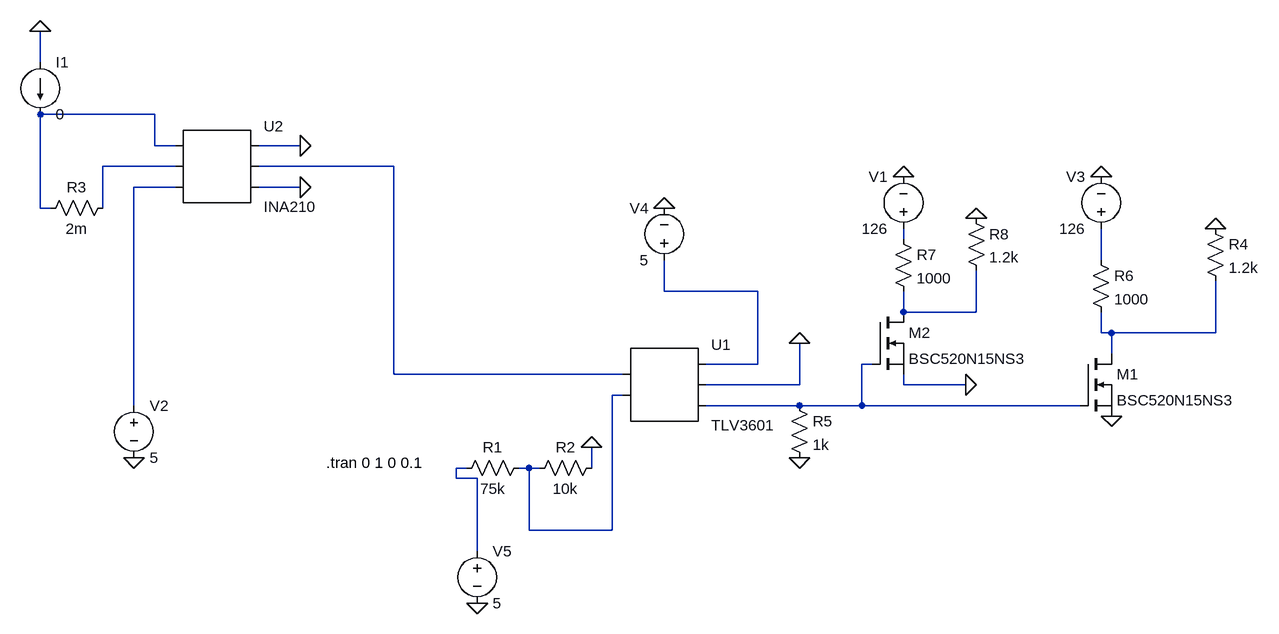
[diagram p0: schematic Discharge Circuit.asc]
Discharge Circuit.asc, the LTspice schematic file:
Version 4
SHEET 1 1844 680
WIRE -1040 -368 -1040 -416
WIRE -864 -288 -1040 -288
WIRE -864 -240 -864 -288
WIRE -832 -240 -864 -240
WIRE -640 -240 -704 -240
WIRE -832 -208 -944 -208
WIRE -496 -208 -704 -208
WIRE -832 -176 -896 -176
WIRE -640 -176 -704 -176
WIRE -1040 -144 -1040 -288
WIRE -1024 -144 -1040 -144
WIRE -944 -144 -944 -208
WIRE 288 -96 288 -112
WIRE 592 -64 592 -112
WIRE -80 -16 -80 -64
WIRE 64 -16 -80 -16
WIRE 288 16 288 -16
WIRE 400 16 400 -48
WIRE 400 16 288 16
WIRE 592 48 592 16
WIRE 608 48 592 48
WIRE 768 48 768 -32
WIRE 768 48 608 48
WIRE 608 80 608 48
WIRE 64 96 64 -16
WIRE 64 96 -16 96
WIRE 240 96 224 96
WIRE -496 112 -496 -208
WIRE -144 112 -496 112
WIRE 128 128 128 64
WIRE 128 128 -16 128
WIRE 288 128 288 112
WIRE 384 128 288 128
WIRE -144 144 -160 144
WIRE -896 160 -896 -176
WIRE 128 160 -16 160
WIRE 224 160 224 96
WIRE 224 160 128 160
WIRE 560 160 224 160
WIRE -384 256 -400 256
WIRE -288 256 -304 256
WIRE -272 256 -288 256
WIRE -192 256 -192 224
WIRE -400 272 -400 256
WIRE -368 272 -400 272
WIRE -288 352 -288 256
WIRE -160 352 -160 144
WIRE -160 352 -288 352
WIRE -368 384 -368 272
FLAG -192 224 0
FLAG -80 -144 0
FLAG -368 464 0
FLAG 128 64 0
FLAG -896 240 0
FLAG -640 -240 0
FLAG -640 -176 0
FLAG -1040 -416 0
FLAG 592 -192 0
FLAG 768 -112 0
FLAG 608 176 0
FLAG 128 240 0
FLAG 384 128 0
FLAG 400 -128 0
FLAG 288 -192 0
SYMBOL voltage -896 144 R0
WINDOW 123 0 0 Left 0
WINDOW 39 0 0 Left 0
SYMATTR InstName V2
SYMATTR Value 5
SYMBOL res -288 240 R90
WINDOW 0 0 56 VBottom 2
WINDOW 3 32 56 VTop 2
SYMATTR InstName R1
SYMATTR Value 75k
SYMBOL res -176 240 R90
WINDOW 0 0 56 VBottom 2
WINDOW 3 32 56 VTop 2
SYMATTR InstName R2
SYMATTR Value 10k
SYMBOL voltage -80 -48 R180
WINDOW 0 24 96 Left 2
WINDOW 3 24 16 Left 2
WINDOW 123 0 0 Left 0
WINDOW 39 0 0 Left 0
SYMATTR InstName V4
SYMATTR Value 5
SYMBOL voltage -368 368 R0
WINDOW 123 0 0 Left 0
WINDOW 39 0 0 Left 0
SYMATTR InstName V5
SYMATTR Value 5
SYMBOL AutoGenerated\\TLV3601 -80 128 R0
SYMATTR InstName U1
SYMBOL AutoGenerated\\INA210 -768 -208 R0
SYMATTR InstName U2
SYMBOL res -928 -160 R90
WINDOW 0 0 56 VBottom 2
WINDOW 3 32 56 VTop 2
SYMATTR InstName R3
SYMATTR Value 2m
SYMBOL current -1040 -368 R0
WINDOW 123 0 0 Left 0
WINDOW 39 0 0 Left 0
SYMATTR InstName I1
SYMATTR Value 0
SYMBOL res 576 -80 R0
SYMATTR InstName R6
SYMATTR Value 1000
SYMBOL voltage 592 -96 R180
WINDOW 0 24 96 Left 2
WINDOW 3 24 16 Left 2
WINDOW 123 0 0 Left 0
WINDOW 39 0 0 Left 0
SYMATTR InstName V3
SYMATTR Value 126
SYMBOL res 752 -128 R0
SYMATTR InstName R4
SYMATTR Value 1.2k
SYMBOL nmos 560 80 R0
SYMATTR InstName M1
SYMATTR Value BSC520N15NS3
SYMBOL res 112 144 R0
SYMATTR InstName R5
SYMATTR Value 1k
SYMBOL voltage 288 -96 R180
WINDOW 0 24 96 Left 2
WINDOW 3 24 16 Left 2
WINDOW 123 0 0 Left 0
WINDOW 39 0 0 Left 0
SYMATTR InstName V1
SYMATTR Value 126
SYMBOL res 272 -112 R0
SYMATTR InstName R7
SYMATTR Value 1000
SYMBOL nmos 240 16 R0
SYMATTR InstName M2
SYMATTR Value BSC520N15NS3
SYMBOL res 384 -144 R0
SYMATTR InstName R8
SYMATTR Value 1.2k
TEXT -600 248 Left 2 !.tran 0 1 0 0.1

The netlist it stands for:
* Discharge Circuit.asc
V2 N004 0 5
R1 N011 N012 75k
R2 0 N011 10k
V4 N007 0 5
V5 N012 0 5
* U1: TLV3601 (symbol AutoGenerated\TLV3601 not available, pins judged from their places): pin1=N003 pin2=N011 pin3=N007 pin4=0 pin5=N010
* U2: INA210 (symbol AutoGenerated\INA210 not available, pins judged from their places): pin1=N001 pin2=N002 pin3=N004 pin4=0 pin5=N003 pin6=0
R3 N002 N001 2m
I1 0 N001 0
R6 N006 N009 1000
V3 N006 0 126
R4 0 N009 1.2k
M1 N009 N010 0 0 BSC520N15NS3
R5 N010 0 1k
V1 N005 0 126
R7 N005 N008 1000
M2 N008 N010 0 0 BSC520N15NS3
R8 0 N008 1.2k
.model NMOS NMOS
.model PMOS PMOS
.lib standard.mos
.tran 0 1 0 0.1
.backanno
.end